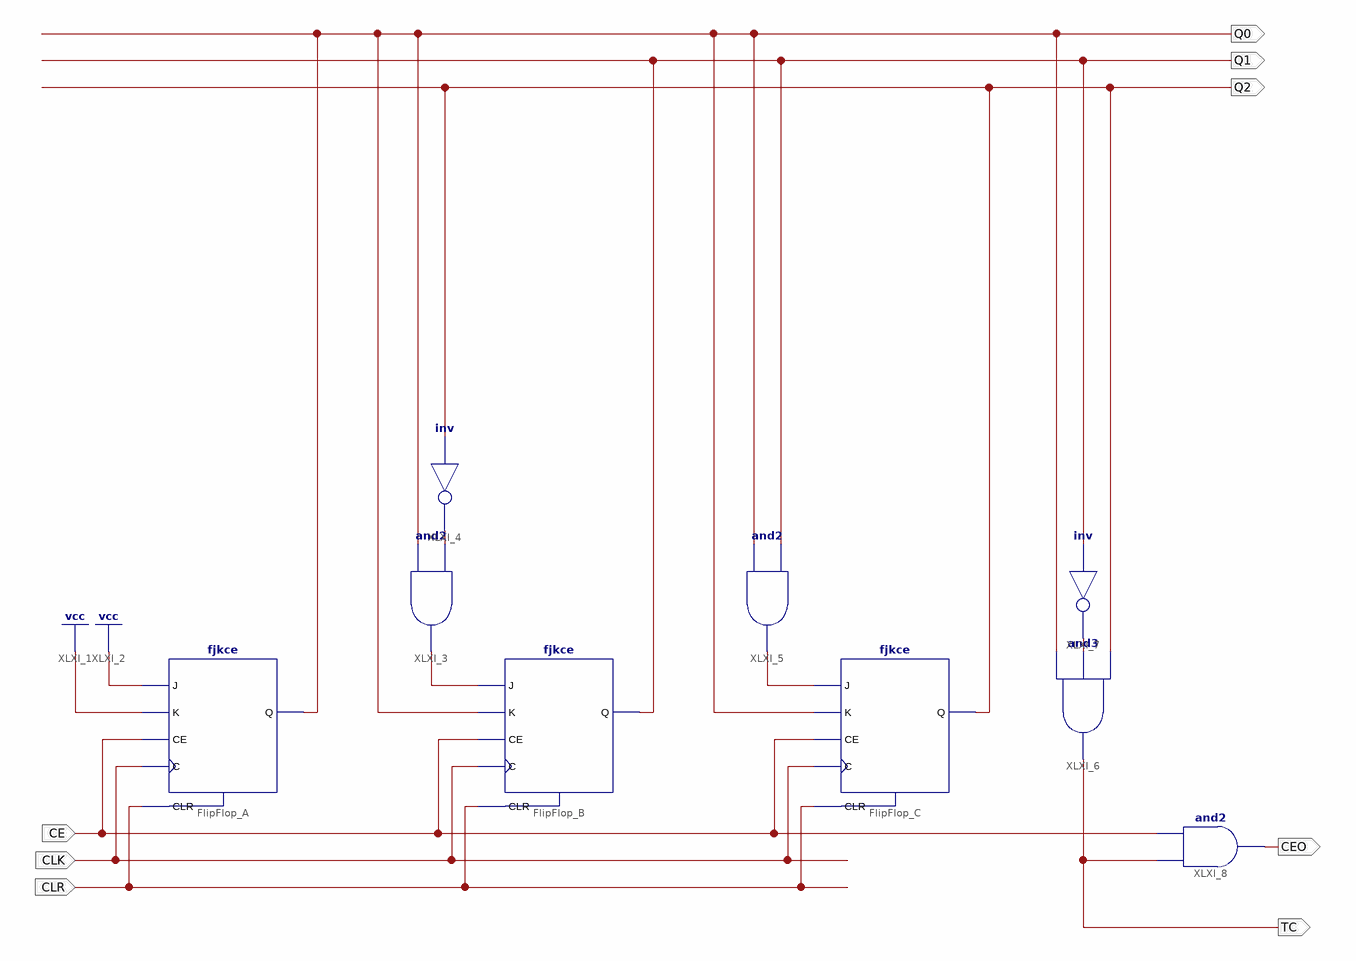
[diagram p0: schematic sheet 1]
// Xilinx ISE schematic counter0_5.sch (spartan6) as structural Verilog: 9 symbols, 8 ports
module counter0_5 (
  input  CE,
  input  CLK,
  input  CLR,
  output CEO,
  output TC,
  output Q0,
  output Q1,
  output Q2
);

  wire XLXN_3, XLXN_4, XLXN_5, XLXN_6;

  fjkce FlipFlop_A (.C(CLK), .CE(CE), .CLR(CLR), .J(1'b1), .K(1'b1), .Q(Q0));
  and XLXI_3 (XLXN_3, Q0, XLXN_4);
  not XLXI_4 (XLXN_4, Q2);
  fjkce FlipFlop_B (.C(CLK), .CE(CE), .CLR(CLR), .J(XLXN_3), .K(Q0), .Q(Q1));
  and XLXI_5 (XLXN_5, Q0, Q1);
  fjkce FlipFlop_C (.C(CLK), .CE(CE), .CLR(CLR), .J(XLXN_5), .K(Q0), .Q(Q2));
  and XLXI_6 (TC, Q0, XLXN_6, Q2);
  not XLXI_7 (XLXN_6, Q1);
  and XLXI_8 (CEO, CE, TC);
endmodule
